# EAGLE design tes1 (EAGLE 6.4)
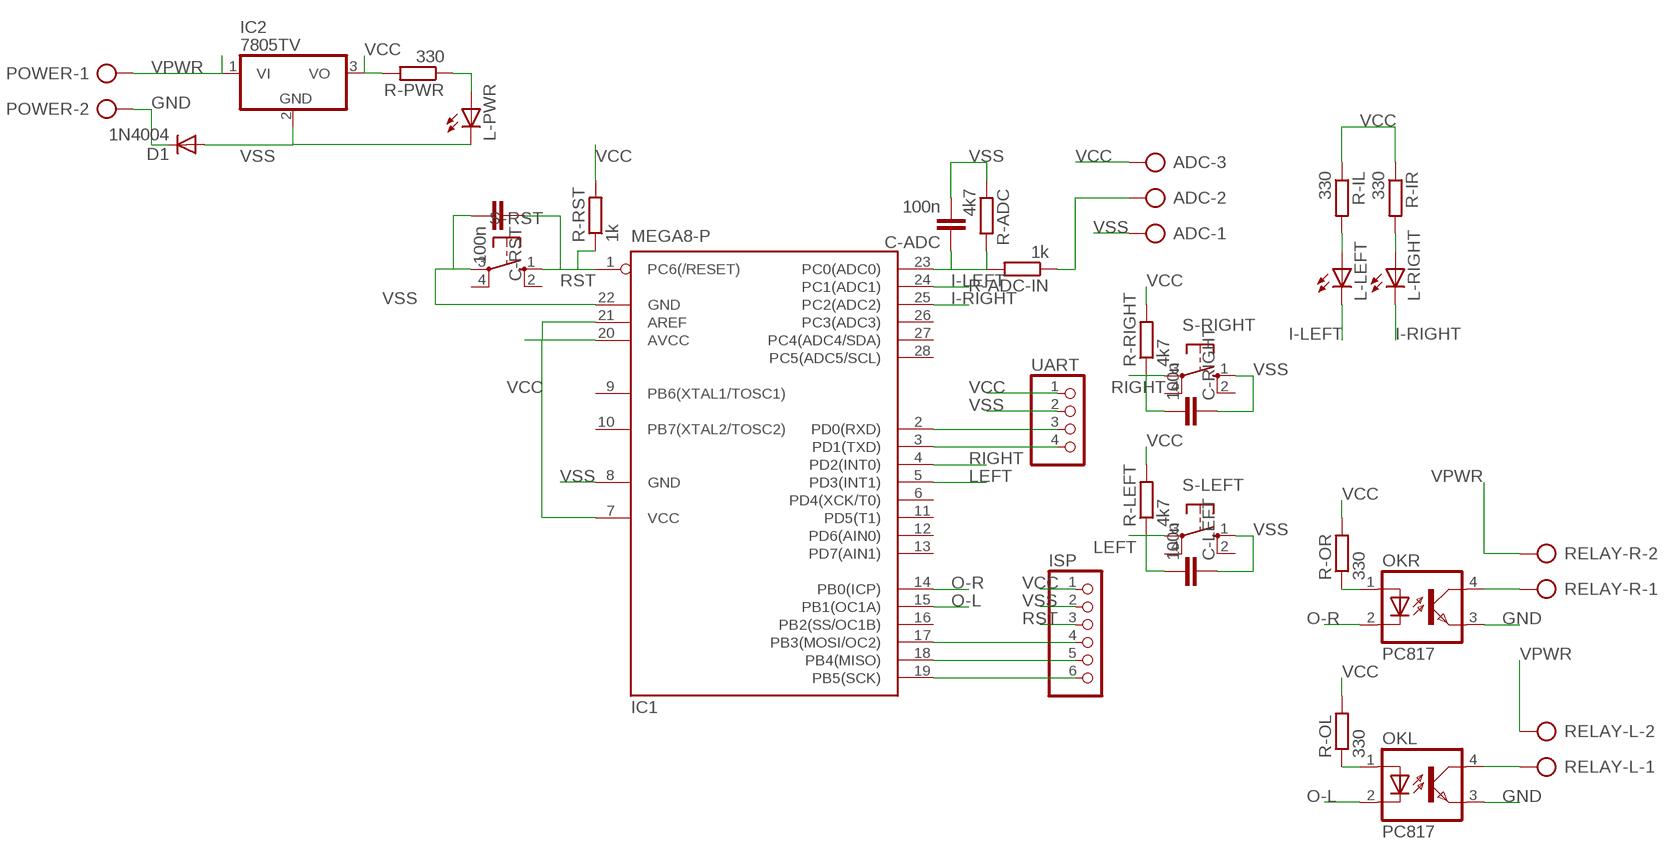
[diagram p0: schematic, sheet 1]

## Parts
ADC  AK300/3  [AK300/3]
C-ADC  100n  C-EU050-024X044  [C050-024X044]
C-LEFT  100n  C-EU050-024X044  [C050-024X044]
C-RIGHT  100n  C-EU050-024X044  [C050-024X044]
C-RST  100n  C-EU050-024X044  [C050-024X044]
D1  1N4004  [DO41-10]
IC1  MEGA8-P  [DIL28-3]
IC2  7805TV  [TO220V]
ISP  PINHD-1X6  [1X06]
L-LEFT  LED3MM  [LED3MM]
L-PWR  LED3MM  [LED3MM]
L-RIGHT  LED3MM  [LED3MM]
OKL  PC817  [DIL04]
OKR  PC817  [DIL04]
POWER  AK300/2  [AK300/2]
R-ADC  4k7  R-EU_0204/7  [0204/7]
R-ADC-IN  1k  R-EU_0204/7  [0204/7]
R-IL  330  R-EU_0204/7  [0204/7]
R-IR  330  R-EU_0204/7  [0204/7]
R-LEFT  4k7  R-EU_0204/7  [0204/7]
R-OL  330  R-EU_0204/7  [0204/7]
R-OR  330  R-EU_0204/7  [0204/7]
R-PWR  330  R-EU_0204/7  [0204/7]
R-RIGHT  4k7  R-EU_0204/7  [0204/7]
R-RST  1k  R-EU_0204/7  [0204/7]
RELAY-L  AK300/2  [AK300/2]
RELAY-R  AK300/2  [AK300/2]
S-LEFT  10-XX  [B3F-10XX]
S-RIGHT  10-XX  [B3F-10XX]
S-RST  10-XX  [B3F-10XX]
UART  PINHD-1X4  [1X04]

## Nets
GND: D1.C OKL.3(EMIT) OKR.3(EMIT) POWER.2
I-LEFT: IC1.24(PC1(ADC1)) L-LEFT.K(C)
I-RIGHT: IC1.25(PC2(ADC2)) L-RIGHT.K(C)
LEFT: C-LEFT.2 IC1.5(PD3(INT1)) R-LEFT.1 S-LEFT.3(P)
N$1: ADC.2 R-ADC-IN.1
N$7: C-ADC.1 IC1.23(PC0(ADC0)) R-ADC-IN.2 R-ADC.2
N$9: IC1.3(PD1(TXD)) UART.4
N$10: IC1.2(PD0(RXD)) UART.3
N$24: L-PWR.A R-PWR.1
N$26: OKR.1(A) R-OR.1
N$29: OKL.1(A) R-OL.1
N$34: OKR.4(COL) RELAY-R.1
N$36: OKL.4(COL) RELAY-L.1
N$40: IC1.19(PB5(SCK)) ISP.6
N$41: IC1.18(PB4(MISO)) ISP.5
N$42: IC1.17(PB3(MOSI/OC2)) ISP.4
N$48: L-LEFT.A R-IL.2
N$51: L-RIGHT.A R-IR.2
O-L: IC1.15(PB1(OC1A)) OKL.2(C)
O-R: IC1.14(PB0(ICP)) OKR.2(C)
RIGHT: C-RIGHT.2 IC1.4(PD2(INT0)) R-RIGHT.1 S-RIGHT.3(P)
RST: C-RST.1 IC1.1(PC6(/RESET)) ISP.3 R-RST.1 S-RST.1(S)
VCC: ADC.3 IC1.7(VCC) IC1.20(AVCC) IC1.21(AREF) IC2.3(VO) ISP.1 R-IL.1 R-IR.1 R-LEFT.2 R-OL.2 R-OR.2 R-PWR.2 R-RIGHT.2 R-RST.2 UART.1
VPWR: IC2.1(VI) POWER.1 RELAY-L.2 RELAY-R.2
VSS: ADC.1 C-ADC.2 C-LEFT.1 C-RIGHT.1 C-RST.2 D1.A IC1.8(GND) IC1.22(GND) IC2.2(GND) ISP.2 L-PWR.K(C) R-ADC.1 S-LEFT.1(S) S-RIGHT.1(S) S-RST.3(P) UART.2
Unconnected: IC1.6(PD4(XCK/T0)) IC1.9(PB6(XTAL1/TOSC1)) IC1.10(PB7(XTAL2/TOSC2)) IC1.11(PD5(T1)) IC1.12(PD6(AIN0)) IC1.13(PD7(AIN1)) IC1.16(PB2(SS/OC1B)) IC1.26(PC3(ADC3)) IC1.27(PC4(ADC4/SDA)) IC1.28(PC5(ADC5/SCL)) S-LEFT.2(S1) S-LEFT.4(P1) S-RIGHT.2(S1) S-RIGHT.4(P1) S-RST.2(S1) S-RST.4(P1)

## Library data of the parts
ADC = con-ptr500:AK300/3: CONNECTOR; OC_FARNELL: unknown; OC_NEWARK: unknown
C-ADC C-LEFT C-RIGHT C-RST = resistor:C-EU: CAPACITOR, European symbol
D1 = diode:1N4004: DIODE general purpose rectifier, 1 A
IC1 = atmel:MEGA8-P: MICROCONTROLLER 8 Kbytes FLASH, 1 kbytes SRAM, 512 bytes EEPROM, USART, 4-channel 10 bit ADC, 2-channel 8 bit ADC Pin compatible with Atmega48, ATMega88, ATMega168 Source: avr.lbr; OC_FARNELL: unknown; OC_NEWARK: unknown
IC2 = linear:78*: Positive VOLTAGE REGULATOR Source: http://cache.national.com/ds/LM/LM78L05.pdf http://www.fairchildsemi.com/ds/LM/LM7805.pdf
ISP = pinhead:PINHD-1X6: PIN HEADER
L-LEFT L-PWR L-RIGHT = led:LED: LED OSRAM: - CHIPLED LG R971, LG N971, LY N971, LG Q971, LY Q971, LO R971, LY R971 LH N974, LH R974 LS Q976, LO Q976, LY Q976 LO Q996 - Hyper CHIPLED LW Q18S LB Q993, LB Q99A, LB R99A - SideLED LS A670, LO A670, LY A670, LG A670, LP A670 LB A673, LV A673, LT A673, LW A673 LH A674 LY A675 LS A676, LA A676, LO A676, LY A676, LW A676 LS A679, LY A679, LG A679 - Hyper Micro SIDELED® LS Y876, LA Y876, LO Y876, LY Y876 LT Y87S - SmartLED LW L88C, LW L88S LB L89C, LB L89S, LG L890 LS L89K, LO L89K, LY L89K LS L896, LA L896, LO L896, LY L896 - TOPLED LS T670, LO T670, LY T670, LG T670, LP T670 LSG T670, LSP T670, LSY T670, LOP T670, LYG T670 LG T671, LOG T671, LSG T671 LB T673, LV T673, LT T673, LW T673 LH T674 LS T676, LA T676, LO T676, LY T676, LB T676, LH T676, LSB T676, LW T676 LB T67C, LV T67C, LT T67C, LS T67K, LO T67K, LY T67K, LW E67C LS E67B, LA E67B, LO E67B, LY E67B, LB E67C, LV E67C, LT E67C LW T67C LS T679, LY T679, LG T679 LS T770, LO T770, LY T770, LG T770, LP T770 LB T773, LV T773, LT T773, LW T773 LH T774 LS E675, LA E675, LY E675, LS T675 LS T776, LA T776, LO T776, LY T776, LB T776 LHGB T686 LT T68C, LB T68C - Hyper Mini TOPLED® LB M676 - Mini TOPLED Santana® LG M470 LS M47K, LO M47K, LY M47K Source: http://www.osram.convergy.de LUXEON: - LUMILED® LXK2-PW12-R00, LXK2-PW12-S00, LXK2-PW14-U00, LXK2-PW14-V00 LXK2-PM12-R00, LXK2-PM12-S00, LXK2-PM14-U00 LXK2-PE12-Q00, LXK2-PE12-R00, LXK2-PE12-S00, LXK2-PE14-T00, LXK2-PE14-U00 LXK2-PB12-K00, LXK2-PB12-L00, LXK2-PB12-M00, LXK2-PB14-N00, LXK2-PB14-P00, LXK2-PB14-Q00 LXK2-PR12-L00, LXK2-PR12-M00, LXK2-PR14-Q00, LXK2-PR14-R00 LXK2-PD12-Q00, LXK2-PD12-R00, LXK2-PD12-S00 LXK2-PH12-R00, LXK2-PH12-S00 LXK2-PL12-P00, LXK2-PL12-Q00, LXK2-PL12-R00 Source: www.luxeon.com KINGBRIGHT: KA-3528ASYC Source: www.kingbright.com
OKL OKR = optocoupler:PC817: SHARP OPTO COUPLER; MPN: PC817X4J000F; OC_FARNELL: 9707727; OC_NEWARK: 97K7059
POWER RELAY-L RELAY-R = con-ptr500:AK300/2: CONNECTOR; OC_FARNELL: unknown; OC_NEWARK: unknown
R-ADC R-ADC-IN R-IL R-IR R-LEFT R-OL R-OR R-PWR R-RIGHT R-RST = resistor:R-EU_: RESISTOR, European symbol
S-LEFT S-RIGHT S-RST = switch-omron:10-XX: OMRON SWITCH; MPN: B3F-1000; OC_FARNELL: 176432; OC_NEWARK: 36M3542
UART = pinhead:PINHD-1X4: PIN HEADER

## Board
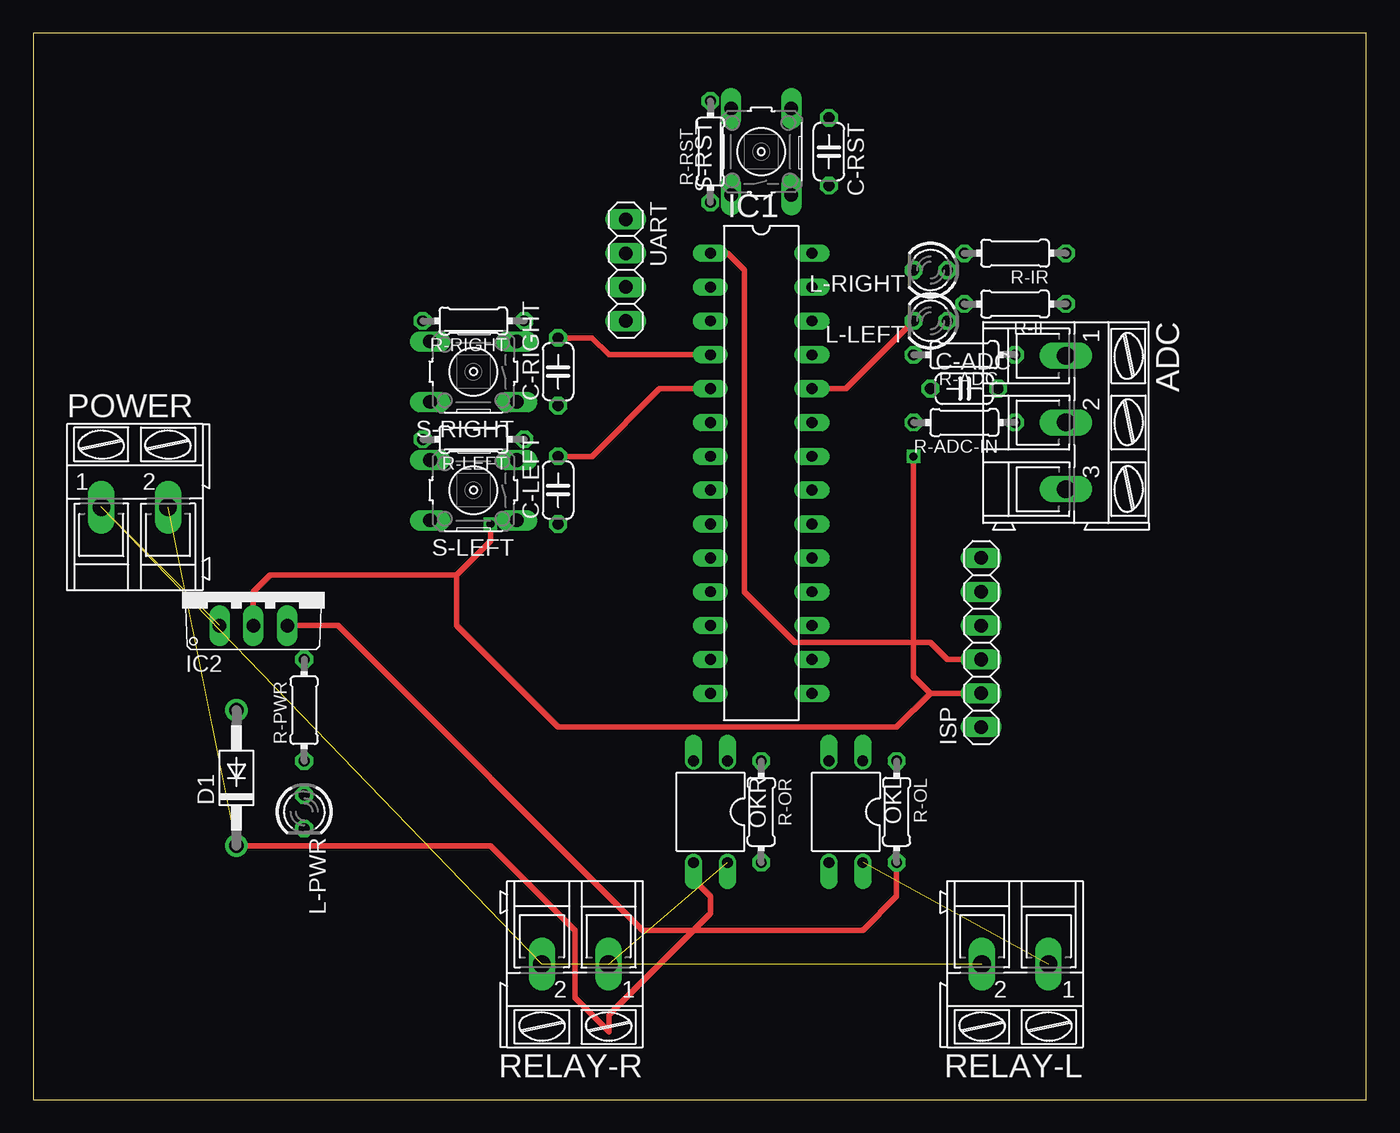
[diagram p1: board, top side]
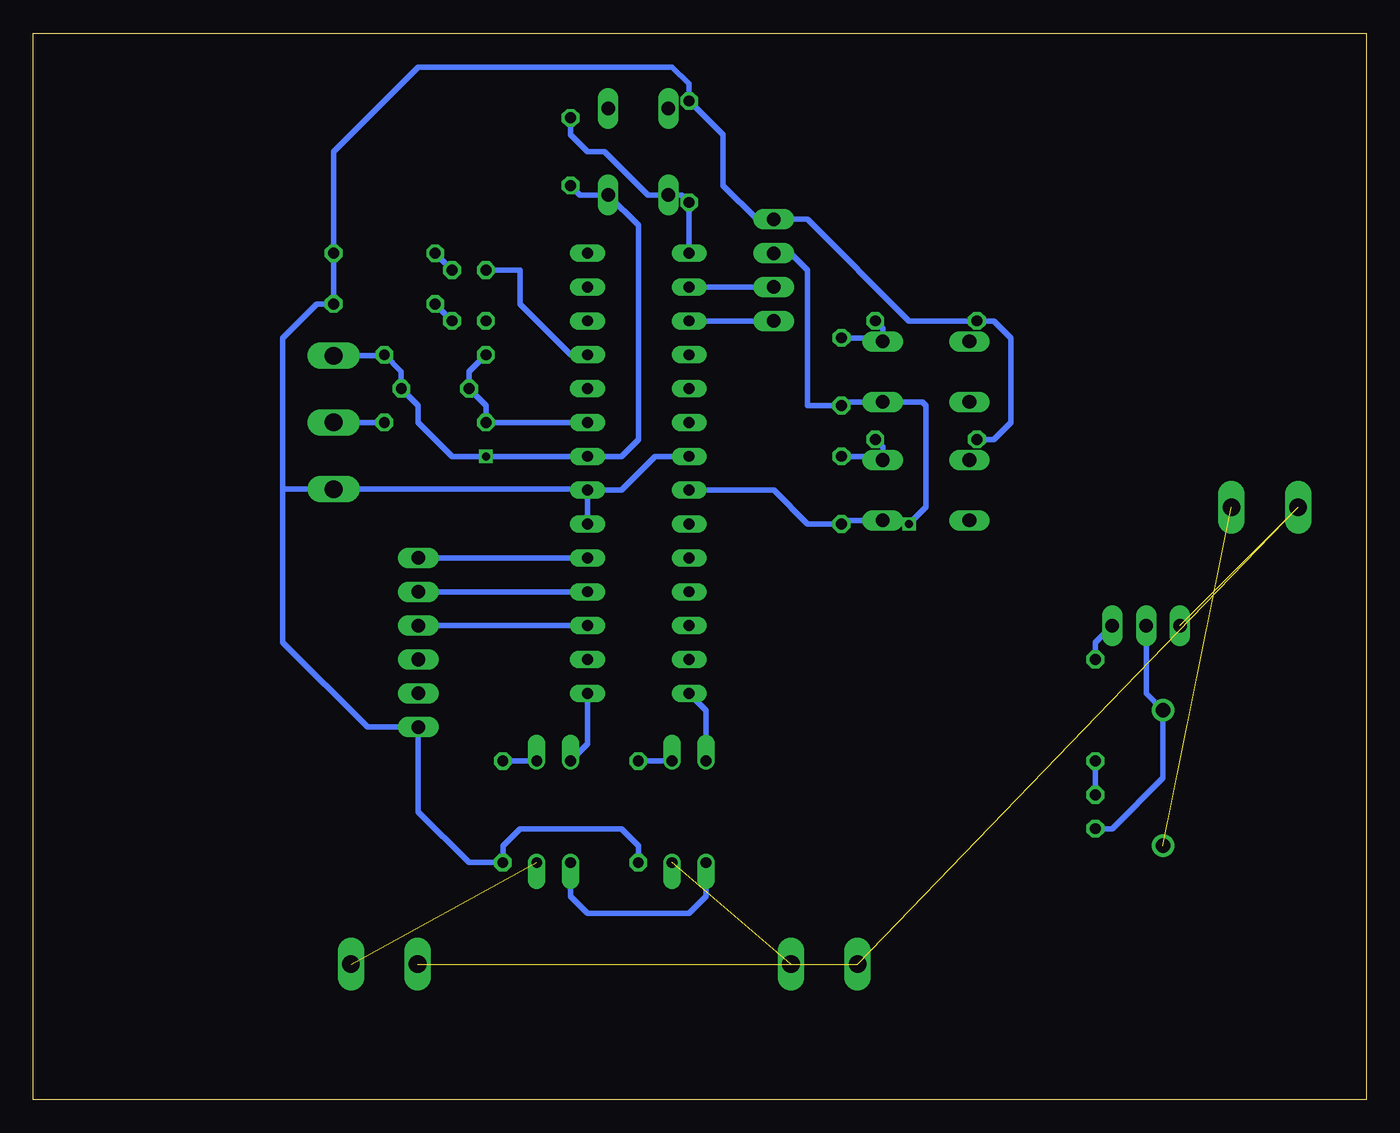
[diagram p2: board, bottom side, seen from below]

Size 100 x 80 mm. Coordinates in mm from the lower left corner, seen from the top.
Outline: 0,0 100,0 100,80 0,80 0,0
Copper layers (1*16): Top 0.035mm / dielectric 1.5mm / Bottom 0.035mm
Design rules "default": minimum track width 10mil, minimum drill 24mil, track to track 8mil, track to pad 8mil, pad to pad 8mil, via to via 8mil, smd to smd 8mil, copper to edge 40mil, drill to drill 8mil, minimum pad ring 10mil, minimum via ring 8mil, stop-mask expansion 4mil, vias tented up to drill 0mil, thermal gap 10mil

### Footprints (pad centres in the part's own frame; a part is rotated, then mirrored left to right if it is on the bottom)
AK300/3 = drill 1.321 long: 1 -5.004,0; 2 0,0; 3 5.004,0
C050-024X044 = drill 0.813 octagon: 1 -2.54,0; 2 2.54,0
DO41-10 = drill 1.118: A 5.08,0; C -5.08,0
DIL28-3 = drill 0.813 long: 1 -16.51,-3.81; 2 -13.97,-3.81; 3 -11.43,-3.81; 4 -8.89,-3.81; 5 -6.35,-3.81; 6 -3.81,-3.81; 7 -1.27,-3.81; 8 1.27,-3.81; 9 3.81,-3.81; 10 6.35,-3.81; 11 8.89,-3.81; 12 11.43,-3.81; 13 13.97,-3.81; 14 16.51,-3.81; 15 16.51,3.81; 16 13.97,3.81; 17 11.43,3.81; 18 8.89,3.81; 19 6.35,3.81; 20 3.81,3.81; 21 1.27,3.81; 22 -1.27,3.81; 23 -3.81,3.81; 24 -6.35,3.81; 25 -8.89,3.81; 26 -11.43,3.81; 27 -13.97,3.81; 28 -16.51,3.81
TO220V = drill 1.016 long: 1 -2.54,-2.54; 2 0,-2.54; 3 2.54,-2.54
1X06 = drill 1.016 long: 1 -6.35,0; 2 -3.81,0; 3 -1.27,0; 4 1.27,0; 5 3.81,0; 6 6.35,0
LED3MM = drill 0.813 octagon: A -1.27,0; K 1.27,0
DIL04 = drill 0.813 offset: 1 -1.27,-3.81; 2 1.27,-3.81; 3 1.27,3.81; 4 -1.27,3.81
AK300/2 = drill 1.321 long: 1 -2.515,0; 2 2.489,0
0204/7 = drill 0.813 octagon: 1 -3.81,0; 2 3.81,0
B3F-10XX = drill 1.016 long: 1 -3.251,2.261; 2 3.251,2.261; 3 -3.251,-2.261; 4 3.251,-2.261
1X04 = drill 1.016 long: 1 -3.81,0; 2 -1.27,0; 3 1.27,0; 4 3.81,0

### Placement (x,y rotation side)
ADC  77.47,50.8 270 top
C-ADC  69.85,53.34 0 top
C-LEFT  39.37,45.72 90 top
C-RIGHT  39.37,54.61 90 top
C-RST  59.69,71.12 270 top
D1  15.24,24.13 90 top
IC1  54.61,46.99 270 top
IC2  16.51,38.1 0 top
ISP  71.12,34.29 90 top
L-LEFT  67.31,58.42 180 top
L-PWR  20.32,21.59 270 top
L-RIGHT  67.31,62.23 180 top
OKL  60.96,21.59 180 top
OKR  50.8,21.59 180 top
POWER  7.62,44.45 0 top
R-ADC  69.85,55.88 180 top
R-ADC-IN  69.85,50.8 180 top
R-IL  73.66,59.69 180 top
R-IR  73.66,63.5 180 top
R-LEFT  33.02,49.53 180 top
R-OL  64.77,21.59 270 top
R-OR  54.61,21.59 270 top
R-PWR  20.32,29.21 90 top
R-RIGHT  33.02,58.42 180 top
R-RST  50.8,71.12 90 top
RELAY-L  73.66,10.16 180 top
RELAY-R  40.64,10.16 180 top
S-LEFT  33.02,45.72 180 top
S-RIGHT  33.02,54.61 180 top
S-RST  54.61,71.12 90 top
UART  44.45,62.23 270 top

### Tracks (layer width: path | path; a pad name or v marks a point on that pad's centre or on a via)
GND  (1 unrouted)
  Top 0.406: D1.C 34.29,19.05 40.64,12.7 40.64,7.62 43.18,5.08 43.18,6.35 50.8,13.97 50.8,15.24 49.53,16.51 OKR.3
  Bottom 0.406: OKL.3 59.69,15.24 58.42,13.97 50.8,13.97 49.53,15.24 OKR.3
I-LEFT
  Top 0.406: IC1.24 60.96,53.34 L-LEFT.K
I-RIGHT
  Bottom 0.406: IC1.25 59.69,55.88 63.5,59.69 63.5,62.23 L-RIGHT.K
LEFT
  Top 0.406: C-LEFT.2 41.91,48.26 46.99,53.34 IC1.5
  Bottom 0.406: R-LEFT.1 36.27,48.97 S-LEFT.3 36.55,48.26 C-LEFT.2
N$1
  Bottom 0.406: ADC.2 R-ADC-IN.1
N$7
  Bottom 0.406: IC1.23 R-ADC-IN.2 66.04,52.07 C-ADC.1 67.31,54.61 R-ADC.2
N$9
  Bottom 0.406: UART.4 IC1.3
N$10
  Bottom 0.406: UART.3 IC1.2
N$24
  Bottom 0.406: L-PWR.A R-PWR.1
N$26
  Bottom 0.406: OKR.1 R-OR.1
N$29
  Bottom 0.406: OKL.1 R-OL.1
N$34  (1 unrouted)
N$36  (1 unrouted)
N$40
  Bottom 0.406: IC1.19 ISP.6
N$41
  Bottom 0.406: IC1.18 ISP.5
N$42
  Bottom 0.406: IC1.17 ISP.4
N$48
  Bottom 0.406: L-LEFT.A R-IL.2
N$51
  Bottom 0.406: R-IR.2 L-RIGHT.A
O-L
  Bottom 0.406: IC1.15 58.42,26.67 OKL.2
O-R
  Bottom 0.406: IC1.14 49.53,29.21 OKR.2
RIGHT
  Top 0.406: C-RIGHT.2 41.91,57.15 43.18,55.88 IC1.4
  Bottom 0.406: R-RIGHT.1 36.27,57.86 S-RIGHT.3 36.55,57.15 C-RIGHT.2
RST
  Top 0.406: IC1.1 52.07,63.5 53.34,62.23 53.34,38.1 57.15,34.29 67.31,34.29 68.58,33.02 ISP.3
  Bottom 0.406: IC1.1 R-RST.1 51.36,67.87 S-RST.1 53.9,67.87 57.15,71.12 58.42,71.12 59.69,72.39 C-RST.1
VCC
  Top 0.406: IC2.3 22.86,35.56 45.72,12.7 62.23,12.7 64.77,15.24 R-OL.2
  Bottom 0.406: R-LEFT.2 27.94,49.53 26.67,50.8 26.67,57.15 27.94,58.42 R-RIGHT.2 34.29,58.42 41.91,66.04 UART.1 45.72,66.04 48.26,68.58 48.26,72.39 R-RST.2 50.8,76.2 52.07,77.47 71.12,77.47 77.47,71.12 R-IR.1 R-IL.1 78.74,59.69 81.28,57.15 81.28,45.72 | R-OR.2 54.61,19.05 55.88,20.32 63.5,20.32 64.77,19.05 R-OL.2 67.31,17.78 71.12,21.59 ISP.1 74.93,27.94 81.28,34.29 81.28,45.72 | IC1.20 IC1.21 | IC1.21 55.88,45.72 53.34,48.26 IC1.7 | 81.28,45.72 81.2,45.8 ADC.3 58.5,45.8 IC1.21 | R-PWR.2 20.32,34.29 IC2.3
VPWR  (3 unrouted)
VSS  (via drill 0.6)
  Top 0.406: IC2.2 16.51,38.1 17.78,39.37 31.75,39.37 | 31.75,39.37 34.29,41.91 v34.29,43.18 | ISP.2 67.31,30.48 | 67.31,30.48 64.77,27.94 39.37,27.94 31.75,35.56 31.75,39.37 | v66.04,48.26 66.04,31.75 67.31,30.48
  Bottom 0.406: C-RST.2 58.98,67.87 S-RST.3 54.61,65.61 54.61,49.53 55.88,48.26 IC1.22 v66.04,48.26 68.58,48.26 71.12,50.8 71.12,52.07 C-ADC.2 72.39,54.61 R-ADC.1 73.74,55.8 ADC.1 | IC1.8 44.45,45.72 41.91,43.18 C-LEFT.1 39.09,43.46 S-LEFT.1 35.99,43.18 v34.29,43.18 33.02,44.45 33.02,52.07 33.3,52.35 S-RIGHT.1 39.09,52.35 C-RIGHT.1 41.91,52.07 41.91,62.23 43.18,63.5 UART.2 | IC2.2 16.51,30.48 D1.A 15.24,24.13 19.05,20.32 L-PWR.K